# EAGLE schematic ArduinoWriter (EAGLE 9.6.2)
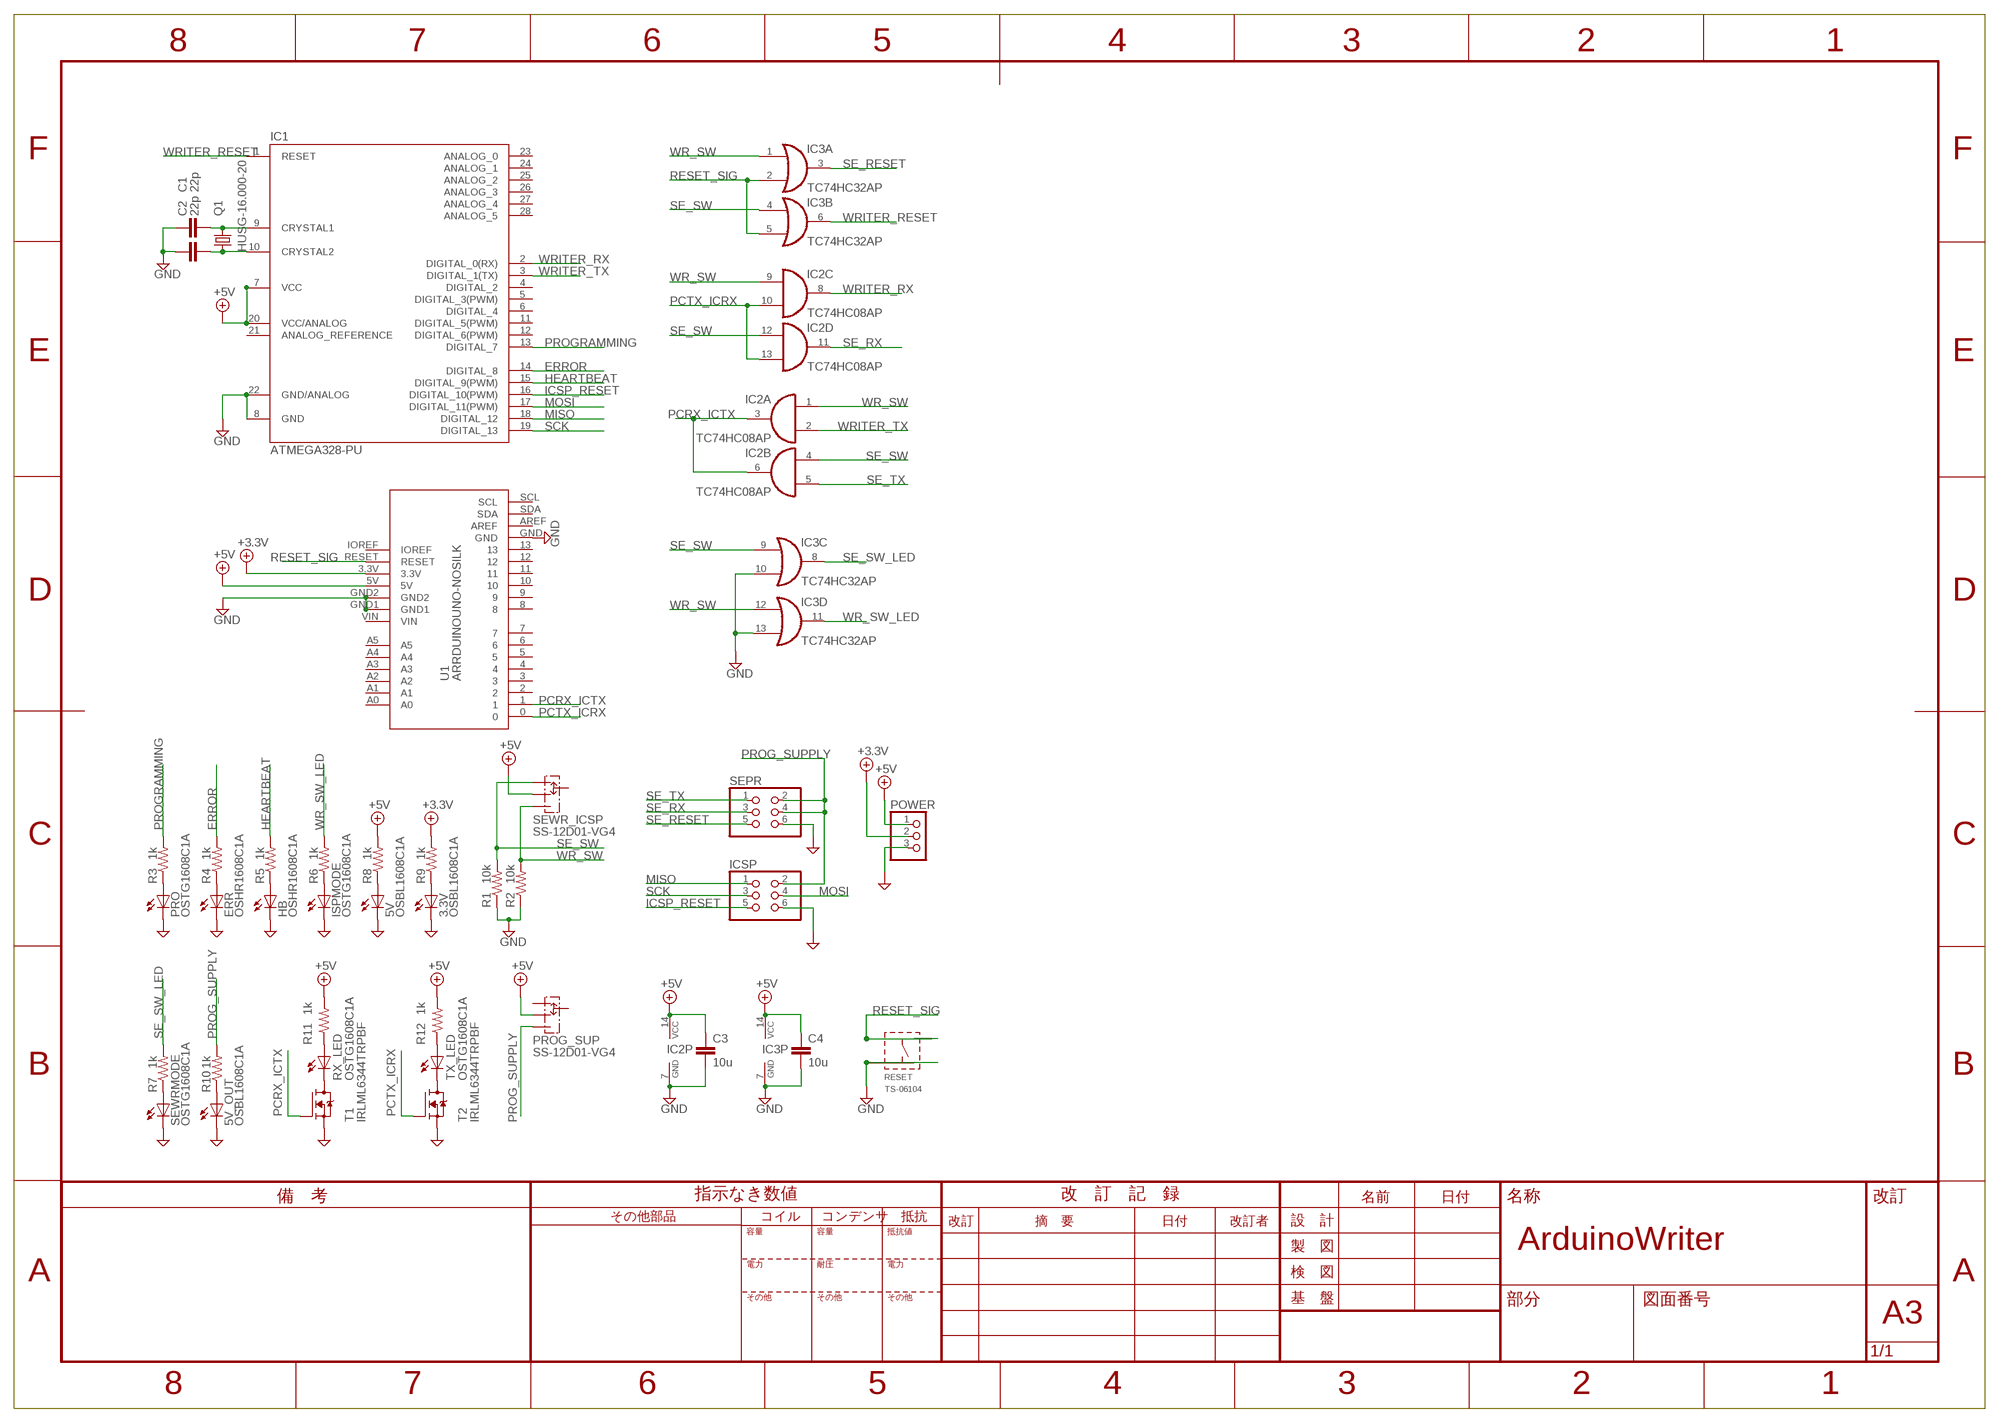
[diagram p0: schematic, sheet 1]

## Parts
3.3V  OSBL1608C1A  [LEDC1608X39N_B]
5V  OSBL1608C1A  [LEDC1608X39N_B]
5V_OUT  OSBL1608C1A  [LEDC1608X39N_B]
C1  22p  C1608  [C0603]
C2  22p  C1608  [C0603]
C3  10u  C2012  [C0805]
C4  10u  C2012  [C0805]
ERR  OSHR1608C1A  [LEDC1608X39N_R]
HB  OSHR1608C1A  [LEDC1608X39N_R]
IC1  ATMEGA328-PU  [DIL28-3]
IC2  TC74HC08AP  [DIL14]
IC3  TC74HC32AP  [DIL14]
ICSP  PINHD-2X3/90  [2X03/90]
ISPMODE  OSTG1608C1A  [LEDC1608X39N_G]
POWER  PINHD-1X3  [1X03]
PRO  OSTG1608C1A  [LEDC1608X39N_G]
PROG_SUP  SS-12D01-VG4  [SS-12D01-VG4]
Q1  HUSG-16.000-20  [XTALRR480W50L990T368H350B]
R1  10k  R1608  [R0603]
R2  10k  R1608  [R0603]
R3  1k  R1608  [R0603]
R4  1k  R1608  [R0603]
R5  1k  R1608  [R0603]
R6  1k  R1608  [R0603]
R7  1k  R1608  [R0603]
R8  1k  R1608  [R0603]
R9  1k  R1608  [R0603]
R10  1k  R1608  [R0603]
R11  1k  R1608  [R0603]
R12  1k  R1608  [R0603]
RESET  TS-06104  [TS-06104]
RX_LED  OSTG1608C1A  [LEDC1608X39N_G]
SEPR  PINHD-2X3/90  [2X03/90]
SEWR_ICSP  SS-12D01-VG4  [SS-12D01-VG4]
SEWRMODE  OSTG1608C1A  [LEDC1608X39N_G]
T1  IRLML6344TRPBF  [SOT95P240X110-3N]
T2  IRLML6344TRPBF  [SOT95P240X110-3N]
TX_LED  OSTG1608C1A  [LEDC1608X39N_G]
U1  ARRDUINOUNO-NOSILK  [ARDUINOUNO_NOSILK]

## Nets
+3.3V: POWER.2 R9.2 U1.3.3V
+5V: C3.1 C4.1 IC1.7(VCC) IC1.20(VCC/ANALOG) IC2.14(P:VCC) IC3.14(P:VCC) POWER.1 PROG_SUP.COM R8.2 R11.2 R12.2 SEWR_ICSP.COM U1.5V
ERROR: IC1.14(DIGITAL_8) R4.2
GND: 3.3V.2(C) 5V.2(C) 5V_OUT.2(C) C1.1 C2.1 C3.2 C4.2 ERR.2(C) HB.2(C) IC1.8(GND) IC1.22(GND/ANALOG) IC2.7(P:GND) IC3.7(P:GND) IC3.10(C:I1) IC3.13(D:I1) ICSP.6 ISPMODE.K(C) POWER.3 PRO.K(C) R1.1 R2.1 RESET.B1(T3) RESET.B2(T4) SEPR.6 SEWRMODE.K(C) T1.2(S) T2.2(S) U1.GND U1.GND1 U1.GND2
HEARTBEAT: IC1.15(DIGITAL_9(PWM)) R5.2
ICSP_RESET: IC1.16(DIGITAL_10(PWM)) ICSP.5
MISO: IC1.18(DIGITAL_12) ICSP.1
MOSI: IC1.17(DIGITAL_11(PWM)) ICSP.4
N$1: C2.2 IC1.10(CRYSTAL2) Q1.1
N$2: C1.2 IC1.9(CRYSTAL1) Q1.2
N$3: PRO.A R3.1
N$4: ERR.1(A) R4.1
N$5: HB.1(A) R5.1
N$6: ISPMODE.A R6.1
N$7: R7.1 SEWRMODE.A
N$8: 5V.1(A) R8.1
N$9: 3.3V.1(A) R9.1
N$10: 5V_OUT.1(A) R10.1
N$11: RX_LED.K(C) T1.3(D)
N$12: T2.3(D) TX_LED.K(C)
N$13: R11.1 RX_LED.A
N$14: R12.1 TX_LED.A
PCRX_ICTX: IC2.3(A:O) IC2.6(B:O) T1.1(G) U1.1
PCTX_ICRX: IC2.10(C:I1) IC2.13(D:I1) T2.1(G) U1.0
PROG_SUPPLY: ICSP.2 PROG_SUP.NO R10.2 SEPR.2 SEPR.4
PROGRAMMING: IC1.13(DIGITAL_7) R3.2
RESET_SIG: IC3.2(A:I1) IC3.5(B:I1) RESET.A1(T1) RESET.A2(T2) U1.RESET
SCK: IC1.19(DIGITAL_13) ICSP.3
SE_RESET: IC3.3(A:O) SEPR.5
SE_RX: IC2.11(D:O) SEPR.3
SE_SW: IC2.4(B:I0) IC2.12(D:I0) IC3.4(B:I0) IC3.9(C:I0) R1.2 SEWR_ICSP.NC
SE_SW_LED: IC3.8(C:O) R7.2
SE_TX: IC2.5(B:I1) SEPR.1
WR_SW: IC2.1(A:I0) IC2.9(C:I0) IC3.1(A:I0) IC3.12(D:I0) R2.2 SEWR_ICSP.NO
WR_SW_LED: IC3.11(D:O) R6.2
WRITER_RESET: IC1.1(RESET) IC3.6(B:O)
WRITER_RX: IC1.2(DIGITAL_0(RX)) IC2.8(C:O)
WRITER_TX: IC1.3(DIGITAL_1(TX)) IC2.2(A:I1)
Unconnected: IC1.4(DIGITAL_2) IC1.5(DIGITAL_3(PWM)) IC1.6(DIGITAL_4) IC1.11(DIGITAL_5(PWM)) IC1.12(DIGITAL_6(PWM)) IC1.21(ANALOG_REFERENCE) IC1.23(ANALOG_0) IC1.24(ANALOG_1) IC1.25(ANALOG_2) IC1.26(ANALOG_3) IC1.27(ANALOG_4) IC1.28(ANALOG_5) PROG_SUP.NC U1.2 U1.3 U1.4 U1.5 U1.6 U1.7 U1.8 U1.9 U1.10 U1.11 U1.12 U1.13 U1.A0 U1.A1 U1.A2 U1.A3 U1.A4 U1.A5 U1.AREF U1.IOREF U1.SCL U1.SDA U1.VIN

## Library data of the parts
3.3V 5V 5V_OUT = LED:OSBL1608C1A: 青色チップＬＥＤ ［１６０８］ ＯＳＢＬ１６０８ （２０個入） [OSBL1608C1A] 通販コード I-03982 発売日 2010/07/14 定格(Ta=25℃時) ◆VF：2.9V(IF=5mA) ◆最大電流：30mA ◆輝度1：23mcd(IF=5mA) ◆輝度2：70mcd(IF=20mA) ◆波長：470nm(青色) ◆サイズ：1608 (横1.6x縦0.8x厚さ0.6mm) ◆逆耐圧：5V ◆PD：100mW ■カラーバリエーション 白色I-03986 </catalog/g/gI-03986/> 赤色I-03978 </catalog/g/gI-03978/> 緑色I-06417 </catalog/g/gI-06417/> 青色I-03982 </catalog/g/gI-03982/> 黄色I-03984橙色I-06416 </catalog/g/gI-06416/> 黄緑色I-03980 </catalog/g/gI-03980/> ウォームホワイト色I-09640 </catalog/g/gI-09640> </catalog/g/gI-03984/> ◆販売単位：20個カットテーピング ※4000個単位のリール(I-03983 </catalog/g/gI-03983/>)もございます。 [I-03982] 青色チップＬＥＤ ［１６０８］ ＯＳＢＬ１６０８ （２０個入） </catalog/faq/faq.aspx#10020> 1パック ￥200（税込）
C1-C4 = RCL:C: CAPACITOR, European symbol; SPICEPREFIX: C
ERR HB = LED:OSHR1608C1A: 赤色チップＬＥＤ ［１６０８］ ＯＳＨＲ１６０８ （２０個入） [OSHR1608C1A] 通販コード I-03978 発売日 2010/07/14 メーカーカテゴリ OptoSupply </catalog/goods/search.aspx?maker=optosupp&style=T&search.x=true> 定格(Ta=25℃) ◆VF：1.9V(IF=5mA) ◆最大電流：30mA ◆輝度1：35mcd(IF=5mA) ◆輝度2：140mcd(IF=25mA) ◆最大消費電力：70mW ◆波長：625nm(赤色) ◆サイズ：1608 (横1.6x縦0.8厚0.4mm) ◆逆耐圧：5V ◆PD：70mW ■カラーバリエーション 白色I-03986 </catalog/g/gI-03986/> 赤色I-03978 </catalog/g/gI-03978/> 緑色I-06417 </catalog/g/gI-06417/> 青色I-03982 </catalog/g/gI-03982/> 黄色I-03984橙色I-06416 </catalog/g/gI-06416/> 黄緑色I-03980 </catalog/g/gI-03980/> ウォームホワイト色I-09640 </catalog/g/gI-09640> </catalog/g/gI-03984/> ※4000個単位のリール(I-03979 </catalog/g/gI-03979/>)もございます。 [I-03978] 赤色チップＬＥＤ ［１６０８］ ＯＳＨＲ１６０８ （２０個入） 1パック ￥200（税込）
IC1 = Arduino-AVR:ATMEGA328-PU: ＡＶＲマイコン ＡＴＭＥＧＡ３２８Ｐ－ＰＵ [ATMEGA328P-PU] 通販コード I-03142 発売日 2009/10/05 メーカーカテゴリ Microchip Technology Inc.(マイクロチップ)/Atmel Corporation(アトメル) </catalog/goods/search.aspx?maker=microtip&style=T&search.x=true> ATmega168のメモリ倍増版です。ブートローダと呼ばれるプログラムを書き込んだものは、Arduinoに搭載されるなど電子工作においてポピュラーなマイコンの一つです。 ■主な仕様 ・シリーズ：ATMEGA ・電源電圧：1.8～5.5V ・コア：megaAVR ・コアサイズ：8bit ・クロック：20MHz ・プログラムメモリ：32kB ・EEPROM：1kB ・RAM：2kB ・GPIO：23pin ・UART/USART：1Ch ・I2C：1Ch ・SPI：1Ch ・タイマ：3Ch ・オシレータ：内蔵/外付 ・パッケージ：DIP28 ・ADC：6Ch ※Arduinoとして使用するにはブートローダを書込む必要があります。 ※ブートローダー書込済マイコンもございます⇒I-12774(5V16MHz) </catalog/g/gI-12774/>、I-12775(3.3V8MHz(内蔵)) </catalog/g/gI-12775/> ◆適合ICソケット：(P-01339 </catalog/g/gP-01339/>、P-00013 </catalog/g/gP-00013/>) ※TQFP32版ATmega328Pもございます⇒I-04386 </catalog/g/gI-04386/> 1個 ￥210（税込）
IC2 = 東芝_74LSシリーズ:TC74HC08: Quad 2-input AND gate
IC3 = 東芝_74LSシリーズ:TC74HC32: Quad 2-input OR gate
ICSP SEPR = pinhead:PINHD-2X3: PIN HEADER
ISPMODE PRO RX_LED SEWRMODE TX_LED = LED:OSTG1608C1A: 緑色チップＬＥＤ ［１６０８］ ＯＳＴＧ１６０８Ｃ１Ａ （２０個入） [OSTG1608C1A] 通販コード I-06417 発売日 2013/03/26 ・標準電流：5mA ◆絶対最大定格(Ta=25℃) ・VR：5V ・PD：100mW ◆電気光学特性(IF=5mA、Ta=25℃、Typ.) ・VF：2.9V ・IV：103mcd D：525nm ・2θ1/2：120° ■カラーバリエーション 白色I-03986 </catalog/g/gI-03986/> 赤色I-03978 </catalog/g/gI-03978/> 緑色I-06417 </catalog/g/gI-06417/> 青色I-03982 </catalog/g/gI-03982/> 黄色I-03984 </catalog/g/gI-03984/> 橙色I-06416 </catalog/g/gI-06416/> 黄緑色I-03980 </catalog/g/gI-03980/> ウォームホワイト色I-09640 </catalog/g/gI-09640> [I-06417] 緑色チップＬＥＤ ［１６０８］ ＯＳＴＧ１６０８Ｃ１Ａ （２０個入） 1パック ￥250（税込）
POWER = pinhead:PINHD-1X3: PIN HEADER
PROG_SUP SEWR_ICSP = スライドスイッチ:SS-12D01-VG4: 基板用スライドスイッチ ＳＳ－１２Ｄ０１－ＶＧ４ [SS-12D01-VG4] 通販コード P-08791 発売日 2015/01/20 メーカーカテゴリ Zhejiang Jianfu Electronics Co., Ltd </catalog/goods/search.aspx?maker=jianfu&style=T&search.x=true> ■基板取付用小型スライドスイッチ 両端に補助ガイドがついています。 ■主な仕様 ・種別：スライドスイッチ ・表記：ON-ON ・回路数：1回路 ・接点：1接点 ・定格開閉電圧：50VDC ・定格開閉電流：0.5A ・接触抵抗：30mΩ ・取付タイプ：基板取付 ・電気的接続：スルーホール実装 ・ピン数：5 SS-12D01 PDFデータシート </download/ds/jianfu/SS-12D01-VG4.pdf> タクトスイッチ各種 </catalog/c/ctactsw> トグルスイッチ各種 </catalog/c/ctoggle> スイッチ各種 </catalog/c/csw> 関連商品≫基板 </catalog/c/cboard>(ﾕﾆﾊﾞｰｻﾙ </catalog/c/cuboard> SMD </catalog/c/csuboard> DIP化 </catalog/c/cwithbrd> 変換 </catalog/c/ccpcb> 電力 </catalog/c/cboard11> ｱﾙﾐ </catalog/c/calumi>) / ﾌﾞﾚｯﾄﾞﾎﾞｰﾄﾞ </catalog/c/cbread> / ﾏｲｺﾝ </catalog/c/cmicon_dT>(PIC </catalog/c/cpicr> H8 </catalog/c/ch8> RX </catalog/c/crx>) / TR </catalog/c/ctr>(TO-3P </catalog/c/cto-3p> TO-220 </catalog/c/cto-220> TO-92 </catalog/c/cto-92> SMD </catalog/c/cctr>) / FET </catalog/c/cfet>(Nch </catalog/c/c2sk> Pch </catalog/c/c2sj> SMD </catalog/c/ccfet>) / LED </catalog/c/cled_dT>(3mm </catalog/c/c3mm> 5mm </catalog/c/c5mm> 角型 </catalog/c/csuperflx> SMD </catalog/c/csmdled> 点滅 </catalog/c/cblanking> ﾊﾟﾜｰ </catalog/c/cpwrled> ﾊﾞｰ </catalog/c/cbar> ７ｾｸﾞ </catalog/c/ca7seg>) / ｺﾝﾃﾞﾝｻ </catalog/c/ccap> / ﾀﾞｲｵｰﾄﾞ </catalog/c/cdiode> / 抵抗 </catalog/c/cregister> / VR </catalog/c/cvr> / 電源IC </catalog/c/cpoweric> / ﾘﾚｰ </catalog/c/crelay> / ACｱﾀﾞﾌﾟﾀ </catalog/c/cswpower> / ﾋﾟﾝﾍｯﾀﾞ </catalog/c/cheader> / ﾋﾟﾝｿｹｯﾄ </catalog/c/cframe> / 線材 </catalog/c/csen4> / ﾀｰﾐﾅﾙ </catalog/c/cterminal> / ｺﾈｸﾀ </catalog/c/cconn> / 電池ｹｰｽ </catalog/c/cbattca> / 放熱器 </catalog/c/cheatsink> / 電池一般 </catalog/c/cbatt_dT> / 工作用品 </catalog/c/ckosaku_dT> [P-08791] 基板用スライドスイッチ ＳＳ－１２Ｄ０１－ＶＧ４ </catalog/faq/faq.aspx#10020> </catalog/faq/faq.aspx#10020> 1個 ￥30（税込）
Q1 = 水晶振動子:HUSG-16.000-20: クリスタル（水晶発振子） １６ＭＨｚ [HUSG-16.000-20] 通販コード P-08671 発売日 2014/11/05 メーカーカテゴリ Mercury Electronic Industrial co., Ltd. </catalog/goods/search.aspx?maker=mercury&style=T&search.x=true> 小型のHC-49/S型パッケージのクリスタル(水晶発振子・水晶振動子)です。クリスタル(石英)の圧電効果を利用し安定した周波数源として利用されています。 ■主な仕様 ・シリーズ：HUSG ・周波数：16MHz ・切断方位(カット)：AT ・オーバートーン次数：Fundamental ・負荷容量：20pF ・ドライブレベル：100μW ・等価直列抵抗(ESR)：40Ω ・周波数許容偏差：±30ppm ・周波数安定性：±30ppm ・周波数経年変化：~&#1初年度) ・実装タイプ：スルーホール ・寸法：10.7mm×4.3mm×3.5mm(リード含まず) ・高さ：3.5mm ・使用温度範囲：-10~60℃ [P-08671] クリスタル（水晶発振子） １６ＭＨｚ 1個 ￥30（税込）
R1-R12 = RCL:R: RESISTOR, American symbol; SPICEPREFIX: R
RESET = タクトスイッチ:TS-06104: 表面実装用タクトスイッチ ＴＳ－０６１０４ [TS-06104] 通販コード P-15969 発売日 2020/12/16 メーカーカテゴリ XIAMEN JINBEILI ELECTRONICS CO.,LTD </catalog/goods/search.aspx?maker=jinbeili&style=T&search.x=true> 表面実装タイプのタクトスイッチです。こちらはお客様からご要望を頂き販売を開始いたしました。各種部品、半導体、機構部品等のご要望をお待ちしております。商品リクエスト入力フォーム </catalog/c/cparts99> ■主な仕様 ・種別：タクトスイッチ ・表記：A接点 ・回路数：1回路 ・接点：1接点 ・定格開閉電圧：12VDC ・定格開閉電流：50mA ・接触抵抗：2Ω以下 ・動作：モーメンタリ ・取付タイプ：基板取付 ・電気的接続：表面実装 ・色：黒 ・ピン数：4 TS-06104 PDFデータシート </download/ds/jinbeili/TS-06104.pdf> タクトスイッチ各種 </catalog/c/ctactsw> トグルスイッチ各種 </catalog/c/ctoggle> スイッチ各種 </catalog/c/csw> 関連商品≫組立ｷｯﾄ </catalog/c/ckit_dT> / ﾌﾞﾚｯﾄﾞﾎﾞｰﾄﾞ </catalog/c/cbread> / ﾏｲｺﾝ </catalog/c/cmicon_dT>(PIC </catalog/c/cpicr> H8 </catalog/c/ch8> RX </catalog/c/crx>) / USB </catalog/c/cusb> / TR </catalog/c/ctr>(TO-220 </catalog/c/cto-220> TO-92 </catalog/c/cto-92> TO-3P </catalog/c/cto-3p> SMD </catalog/c/cctr>) / FET </catalog/c/cfet>(Nch </catalog/c/c2sk> Pch </catalog/c/c2sj> SMD </catalog/c/ccfet> TO-252 </catalog/goods/search.aspx?keyword=fet+dpak&goods=i&search=x> SOT-23 </catalog/goods/search.aspx?keyword=sot23&goods=i&name=fet&search=x>) / ﾀﾞｲｵｰﾄﾞ </catalog/c/cdiode>(整流 </catalog/c/csilicon> ｼｮｯﾄｷｰ </catalog/c/cschottky> ﾌﾞﾘｯｼﾞ </catalog/c/cbridge> SMD </catalog/c/csmddiode> CRD </catalog/c/ccrd> ﾂｪﾅ </catalog/c/czd>) / 抵抗 </catalog/c/cregister>(ｶｰﾎﾞﾝ </catalog/goods/search.aspx?keyword=%83J%81%5B%83%7B%83%93&search=x> 金皮 </catalog/goods/search.aspx?keyword=%8B%E0%91%AE%94%E7%96%8C&image=%8C%9F%8D%F5&search=x> 電力 </catalog/c/cregi7> SMD </catalog/c/cchipreg>) / ｲﾝﾀﾞｸﾀ </catalog/c/ccoil> / ｺﾝﾃﾞﾝｻ </catalog/c/ccap>(電解 </catalog/c/cchemicon> 積ｾﾗ </catalog/c/ccap3> ﾁｯﾌﾟ積ｾﾗ </catalog/c/ccap8> 電気二重層 </catalog/c/ccap2>) / LED </catalog/c/cled_dT>(3mm </catalog/c/c3mm> 5mm </catalog/c/c5mm> 角型 </catalog/c/csuperflx> SMD </catalog/c/csmdled> 点滅 </catalog/c/cblanking> ﾊﾟﾜｰ </catalog/c/cpwrled> ﾊﾞｰ </catalog/c/cbar> ７ｾｸﾞ </catalog/c/ca7seg>) / LCD </catalog/c/cclcd> / ACｱﾀﾞﾌﾟﾀ </catalog/c/cswpower> / VR </catalog/c/cvr> / SW </catalog/c/csw>(ﾀｸﾄ </catalog/c/ctactsw> ﾄｸﾞﾙ </catalog/c/ctoggle> 押ﾎﾞﾀﾝ </catalog/c/cpushsw> 自照式 </catalog/c/csw8> ﾛｰﾀﾘ </catalog/c/crotarysw> ｽﾗｲﾄﾞ </catalog/c/cslidesw>) / ｹｰｽ </catalog/c/ccase> / 基板 </catalog/c/cboard>(ﾕﾆﾊﾞｰｻﾙ </catalog/c/cuboard> SMD </catalog/c/csuboard> DIP化 </catalog/c/cwithbrd> 変換 </catalog/c/ccpcb> 電力 </catalog/c/cboard11> ｱﾙﾐ </catalog/c/calumi>) / ﾋﾟﾝﾍｯﾀﾞ </catalog/c/cheader> / ﾋﾟﾝｿｹｯﾄ </catalog/c/cframe> / 線材 </catalog/c/csen4> / ﾀｰﾐﾅﾙ </catalog/c/cterminal> / ｺﾈｸﾀ </catalog/c/cconn> / 電池ｹｰｽ </catalog/c/cbattca> / 電池一般 </catalog/c/cbatt_dT>(鉛蓄電池 </catalog/c/cbatpb> ｱﾙｶﾘ </catalog/e/ealkarine> ﾎﾞﾀﾝ･ｺｲﾝ </catalog/c/cbatcoin>) / 放熱器 </catalog/c/cheat> / ﾊﾟｰﾂ </catalog/c/cparts_dT> [P-15969] 表面実装用タクトスイッチ ＴＳ－０６１０４ </catalog/faq/faq.aspx#10020> 1個 ￥20（税込）
T1 T2 = FET:IRLML6344TRPBF: ＮｃｈＭＯＳＦＥＴ ＩＲＬＭＬ６３４４ＴＲＰＢＦＴＲ （１０個入） [IRLML6344TRPBFTR] 通販コード I-06049 発売日 2012/07/18 メーカーカテゴリ International Rectifier </catalog/goods/search.aspx?maker=ir&style=T&search.x=true> ◆特徴 ・IR社チップMOSFET ・低オン抵抗29mΩ ・SOT23パッケージ ・Nチャンネル ■主な仕様 ・構造：MOSFET ・回路数：1 ・チャネル：N ・ドレイン・ソース間電圧：30V ・ゲート・ソース間電圧：±12V ・ドレイン電流(DC)：5.0A ・ドレイン・ソース間オン抵抗：22mΩ ・許容損失(25℃)：1.3W ・パッケージ：SOT-23 ※DIP化基板⇒P-03659 </catalog/g/gP-03659> P-11966 </catalog/g/gP-11966> [I-06049] ＮｃｈＭＯＳＦＥＴ ＩＲＬＭＬ６３４４ＴＲＰＢＦＴＲ （１０個入） 1パック ￥240（税込）
U1 = Arduino:ARRDUINOUNO

## Net classes
1 power: clearance 0.127 mm